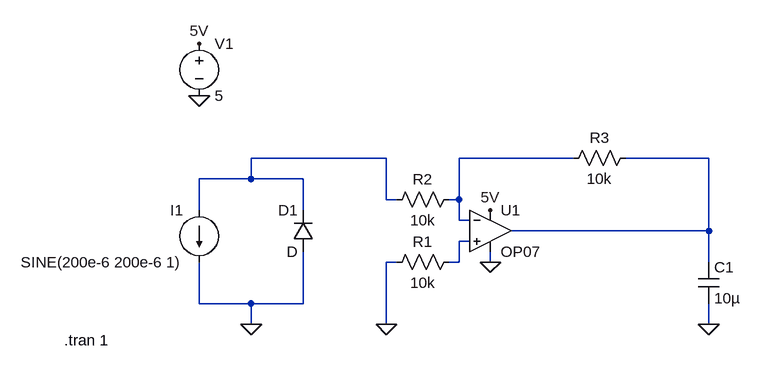
[diagram p0: schematic monitordiode.asc]
monitordiode.asc, the LTspice schematic file:
Version 4
SHEET 1 1432 680
WIRE 384 48 176 48
WIRE 672 48 496 48
WIRE 880 48 752 48
WIRE 176 80 176 48
WIRE 176 80 96 80
WIRE 256 80 176 80
WIRE 384 112 384 48
WIRE 400 112 384 112
WIRE 496 112 496 48
WIRE 496 112 480 112
WIRE 96 128 96 80
WIRE 256 128 256 80
WIRE 496 144 496 112
WIRE 512 144 496 144
WIRE 880 160 880 48
WIRE 880 160 576 160
WIRE 512 176 496 176
WIRE 400 208 384 208
WIRE 496 208 496 176
WIRE 496 208 480 208
WIRE 544 208 544 192
WIRE 880 208 880 160
WIRE 96 272 96 208
WIRE 176 272 96 272
WIRE 256 272 256 192
WIRE 256 272 176 272
WIRE 176 304 176 272
WIRE 384 304 384 208
WIRE 880 304 880 272
FLAG 176 304 0
FLAG 544 208 0
FLAG 96 -48 0
FLAG 96 -128 5V
FLAG 544 128 5V
FLAG 384 304 0
FLAG 880 304 0
SYMBOL current 96 128 M0
WINDOW 123 0 0 Left 0
WINDOW 39 0 0 Left 0
SYMATTR InstName I1
SYMATTR Value SINE(200e-6 200e-6 1)
SYMBOL diode 272 192 R180
WINDOW 0 24 64 Left 2
WINDOW 3 24 0 Left 2
SYMATTR InstName D1
SYMBOL OpAmps\\OP07 544 96 R0
SYMATTR InstName U1
SYMBOL voltage 96 -144 R0
WINDOW 123 0 0 Left 0
WINDOW 39 0 0 Left 0
SYMATTR InstName V1
SYMATTR Value 5
SYMBOL res 496 192 R90
WINDOW 0 0 56 VBottom 2
WINDOW 3 32 56 VTop 2
SYMATTR InstName R1
SYMATTR Value 10k
SYMBOL res 496 96 R90
WINDOW 0 0 56 VBottom 2
WINDOW 3 32 56 VTop 2
SYMATTR InstName R2
SYMATTR Value 10k
SYMBOL res 768 32 R90
WINDOW 0 0 56 VBottom 2
WINDOW 3 32 56 VTop 2
SYMATTR InstName R3
SYMATTR Value 10k
SYMBOL cap 864 208 R0
SYMATTR InstName C1
SYMATTR Value 10µ
TEXT -112 328 Left 2 !.tran 1

The netlist it stands for:
* monitordiode.asc
I1 N001 0 SINE(200e-6 200e-6 1)
D1 0 N001 D
XU1 N004 N002 5V 0 N003 LT1001  ; OP07, pins In+ In- V+ V- OUT
V1 5V 0 5
R1 N004 0 10k
R2 N002 N001 10k
R3 N003 N002 10k
C1 N003 0 10µ
.model D D
.lib standard.dio
.tran 1
.lib LTC.lib
.backanno
.end